# Altium schematic sheet Connectors.SchDoc
size A4
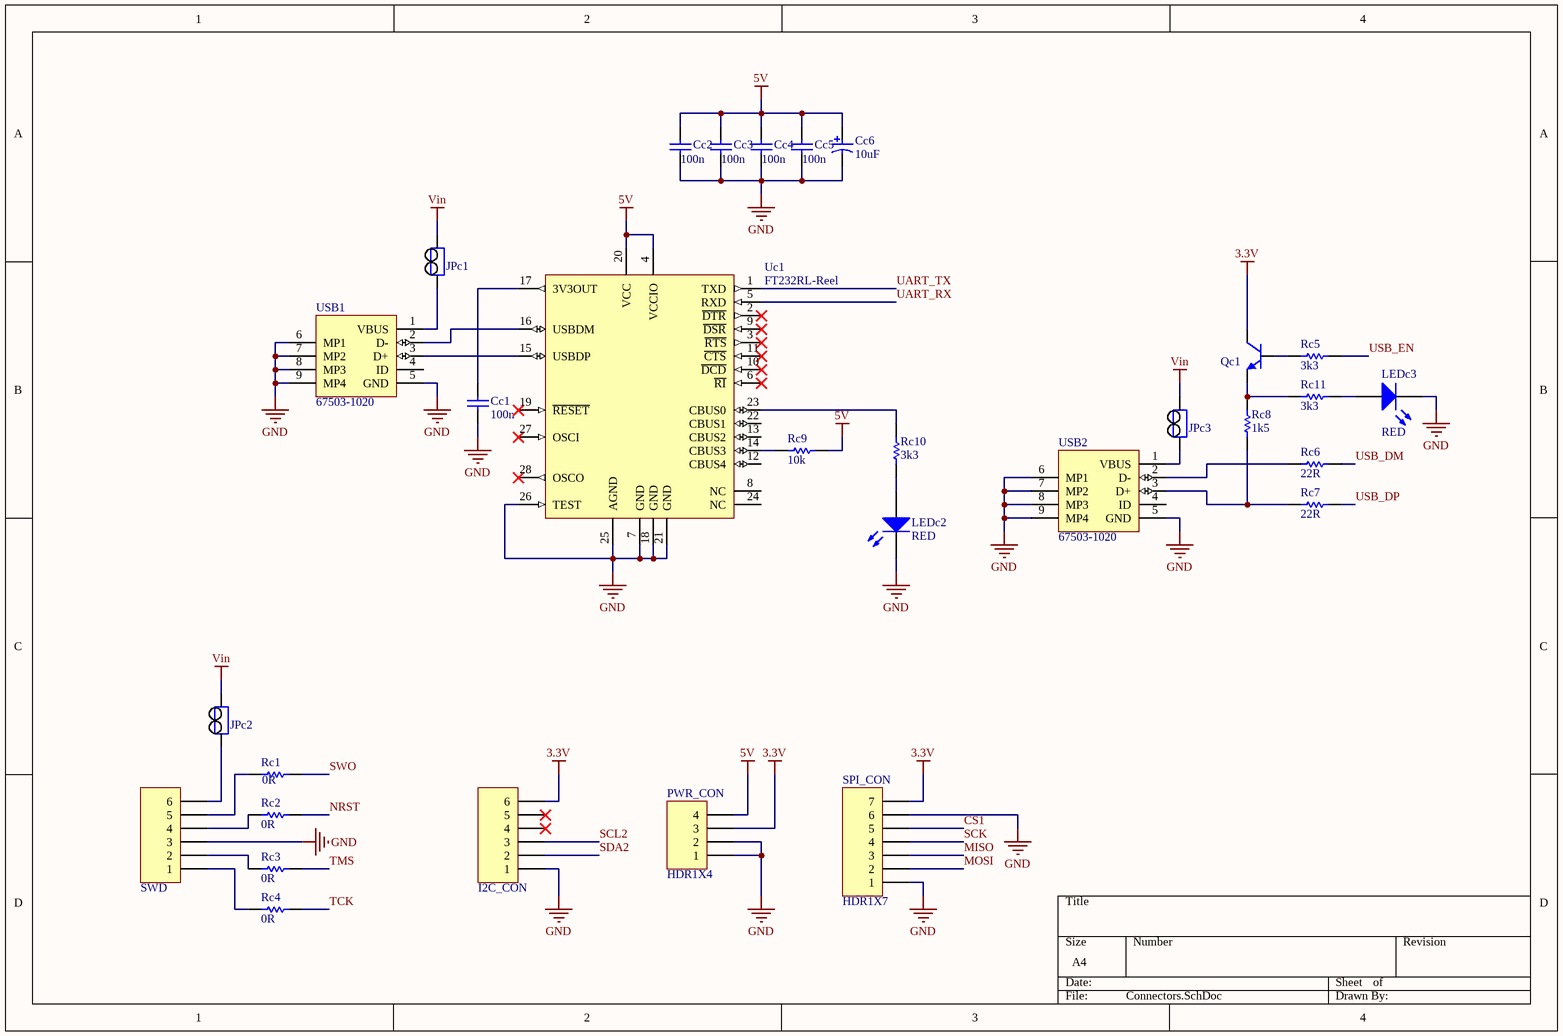
[diagram p0: Connectors.SchDoc]

## Parts
Cc1  100n  [CAPC0603(1608)100_L]
Cc2  100n  [CAPC0603(1608)100_L]
Cc3  100n  [CAPC0603(1608)100_L]
Cc4  100n  [CAPC0603(1608)100_L]
Cc5  100n  [CAPC0603(1608)100_L]
Cc6  10uF  [CAPMP3217X18-T_V]
I2C_CON  HDR1X6  [HDR1X6]  (value not drawn)
JPc1  Jumper  [HDR1X2 - JP]  (value not drawn)
JPc2  Jumper  [HDR1X2 - JP]  (value not drawn)
JPc3  Jumper  [HDR1X2 - JP]  (value not drawn)
LEDc2  RED  [0805_DIODE]
LEDc3  RED  [0805_DIODE]
PWR_CON  HDR1X4  [HDR1X4]
Qc1  BC817-25  [SOT23_N]  (value not drawn)
Rc1  0R  [RESC0603(1608)_L]
Rc2  0R  [RESC0603(1608)_L]
Rc3  0R  [RESC0603(1608)_L]
Rc4  0R  [RESC0603(1608)_L]
Rc5  3k3  [RESC0603(1608)_L]
Rc6  22R  [RESC0603(1608)_L]
Rc7  22R  [RESC0603(1608)_L]
Rc8  1k5  [RESC0603(1608)_L]
Rc9  10k  [RESC0603(1608)_L]
Rc10  3k3  [RESC0603(1608)_L]
Rc11  3k3  [RESC0603(1608)_L]
SPI_CON  HDR1X7  [HDR1X7]
SWD  HDR1X6  [HDR1X6]  (value not drawn)
Uc1  FT232RL-Reel  [SSOP-28_L]
USB1  67503-1020  [MOLX-67503-1020_V]
USB2  67503-1020  [MOLX-67503-1020_V]

## Nets
3.3V: I2C_CON.6 PWR_CON.3 Qc1.3(C) SPI_CON.7
5V: Cc2.2 Cc3.2 Cc4.2 Cc5.2 Cc6.1 PWR_CON.4 Rc9.1 Uc1.4(VCCIO) Uc1.20(VCC)
GND: Cc1.1 Cc2.1 Cc3.1 Cc4.1 Cc5.1 Cc6.2 I2C_CON.1 LEDc2.2(K) LEDc3.2(K) PWR_CON.1 PWR_CON.2 SPI_CON.1 SPI_CON.6 SWD.3 Uc1.7(GND) Uc1.18(GND) Uc1.21(GND) Uc1.25(AGND) Uc1.26(TEST) USB1.5(GND) USB1.6(MP1) USB1.7(MP2) USB1.8(MP3) USB1.9(MP4) USB2.5(GND) USB2.6(MP1) USB2.7(MP2) USB2.8(MP3) USB2.9(MP4)
Vin: JPc1.2 JPc2.2 JPc3.2
CS1: SPI_CON.5
MISO: SPI_CON.3
MOSI: SPI_CON.2
NRST: Rc2.2
SCK: SPI_CON.4
SCL2: I2C_CON.3
SDA2: I2C_CON.2
SWO: Rc1.2
TCK: Rc4.2
TMS: Rc3.2
UART_RX: Uc1.5(RXD)
UART_TX: Uc1.1(TXD)
USB_DM: Rc6.2
USB_DP: Rc7.2
USB_EN: Rc5.1
NetCc1_2: Cc1.2 Uc1.17(3V3OUT)
NetJPc1_1: JPc1.1 USB1.1(VBUS)
NetJPc2_1: JPc2.1 SWD.6
NetJPc3_1: JPc3.1 USB2.1(VBUS)
NetLEDc2_1: LEDc2.1(A) Rc10.1
NetLEDc3_1: LEDc3.1(A) Rc11.1
NetQc1_1: Qc1.1(B) Rc5.2
NetQc1_2: Qc1.2(E) Rc8.2 Rc11.2
NetRc1_1: Rc1.1 SWD.5
NetRc2_1: Rc2.1 SWD.4
NetRc3_1: Rc3.1 SWD.2
NetRc4_1: Rc4.1 SWD.1
NetRc6_1: Rc6.1 USB2.2(D-)
NetRc7_1: Rc7.1 Rc8.1 USB2.3(D+)
NetRc9_2: Rc9.2 Uc1.14(CBUS3)
NetRc10_2: Rc10.2 Uc1.23(CBUS0)
NetUc1_15: Uc1.15(USBDP) USB1.3(D+)
NetUc1_16: Uc1.16(USBDM) USB1.2(D-)

Not connected (* = marked no-connect by the designer): I2C_CON 4* 5*; Uc1 2(~{DTR})* 3(~{RTS})* 6(~{RI})* 8(NC) 9(~{DSR})* 10(~{DCD})* 11(~{CTS})* 12(CBUS4) 13(CBUS2) 19(~{RESET})* 22(CBUS1) 24(NC) 27(OSCI)* 28(OSCO)*; USB1 4(ID); USB2 4(ID)

## Library data of the parts
Cc1-Cc5 = CMP-1590-00005-1: 0603 (1608 Metric) Chip Capacitor; Case-Metric: 1608; Case-EIA: 0603; PackageReference: CAPC0603(1608)100
Cc6 = CMP-1661-00003-1: Standard Tantalum, 1 uF, +/- 10%, 35 V, -55 to 125 degC, 2-Pin SMD (1206), RoHS, Tape and Reel; Current Rating: 200 mA; Voltage Rating (DC): 30 V; REACH SVHC: No SVHC; ComponentLink2URL: http://datasheets.avx.com/TAJ.pdf; Pins: 3; PackageReference: CAPMP3217X18-T; Width: 4 mm; ComponentLink3Description: Package Specification; Length: 11.6 mm; PackageDescription: 2-Pin Surface Mount Device, Body 3.2 x 1.65 mm; ComponentLink2Description: Datasheet; Max Operating Temperature: 70 degC; Contact Material: Copper; Contact Finish: Silver; DatasheetVersion: Feb-16; Contact Plating: Silver; Package Quantity: 1000; Height: 7.4 mm; Min Operating Temperature: -20 degC; Packaging: Bulk; RoHSCompliant: true; ComponentLink1URL: http://www.avx.com/; Mount: Through Hole; ComponentLink1Description: Manufacturer URL; ComponentLink3URL: http://www.avx.com/download/software/literature/AVX-Footprint-Library.pdf
I2C_CON SWD = HDR1X6: Header, 6-Pin; LatestRevisionDate: 17-Jul-2002; LatestRevisionNote: Re-released for DXP Platform.; Publisher: Altium Limited
JPc1-JPc3 = Jumper_2: Jumper, 2-Pin
LEDc2 LEDc3 = LED: Light-emitting diode; COLOR: RED
PWR_CON = HDR1X4: Header, 4-Pin; LatestRevisionDate: 17-Jul-2002; LatestRevisionNote: Re-released for DXP Platform.; Publisher: Altium Limited
Qc1 = BC817-25: NPN General-purpose Transistor; Published: 17-Sep-2003; LatestRevisionDate: 12-Dec-2006; LatestRevisionNote: IPC-7351 Footprint Added.; DatasheetVersion: Jun-1999; PackageVersion: May-1999; PackageReference: SOT23; Publisher: Altium Limited; PackageDescription: 3-Pin SOT-23 Package 0.95 mm Pitch, 2.3 mm Lead Span; ComponentLink1Description: Manufacturer Link; ComponentLink1URL: http://www.semiconductors.philips.com/; ComponentLink2Description: Datasheet; ComponentLink2URL: http://www.semiconductors.philips.com/acrobat/datasheets/BC817_BC817W_BC337_5.pdf
Rc1-Rc11 = CMP-1591-00001-1: 0603 (1608 Metric) Chip Resistor; Case-Metric: 1608; Case-EIA: 0603; PackageReference: RESC0603(1608)
SPI_CON = HDR1X7: Header, 7-Pin; LatestRevisionDate: 17-Jul-2002; LatestRevisionNote: Re-released for DXP Platform.; Publisher: Altium Limited
Uc1 = CMP-0078-00029-3: USB UART Asynchronous Serial Data Transfer Chip, 28-pin SSOP, Tape and Reel; Manufacturer: FTDI; PackageVersion: Mar-12; PackageReference: SSOP-28; ComponentLink2Description: Datasheet; DatasheetVersion: ver 2.10, Mar-2012; PackageDescription: 28-Pin Small Outline Package 0.65 mm Pitch; ComponentLink1Description: Manufacturer URL; RevisionNote: DatasheetVersion updated to 2.10 Mar-2012; PartNumber: FT232RL-Reel; ComponentLink1URL: http://www.ftdichip.com/; ComponentLink2URL: http://www.ftdichip.com/Support/Documents/DataSheets/ICs/DS_FT232R.pdf
USB1 USB2 = CMP-0411-00002-1: USB, MINI, SMD, RA KME04-USBMU03A01; Manufacturer: Molex; ComponentLink1URL: http://www.molex.com/; PartNumber: 67503-1020; Mounting Technology: Surface Mount; ComponentLink1Description: Manufacturer URL; Terminal Pitch: 0.8 mm; DatasheetVersion: Rev F, 06/2009; ComponentLink2Description: Datasheet; PackageDescription: Mini USB Connector, SMT, Righer Angle; ComponentLink2URL: http://www.molex.com/pdm_docs/sd/675031020_sd.pdf; PackageReference: 67503-1020